# Altium schematic sheet DiagrammaStrutturale.SchDoc
size 420 x 297 mm; Address1: Address1; Address2: Address2; Address3: Address3; Address4: Address4; SheetNumber: 1; Scale: 1:1; Разраб.: Иванов; Обозначение документа: АБВГ.123456.001 Э3; Пров.: Петров; Утв.: Сидоров; Наименование организации: ОАО "Концерн "МПО-Гидроприбор"; Перв. применение: АБВГ.123456.000; Наименование изделия 1: Плата; Наименование изделия 2: Схема электрическая; Наименование изделия 3: принципиальная; Нач. отд.: Нач. отд.; Фамилия нач. отд.: Сидоров
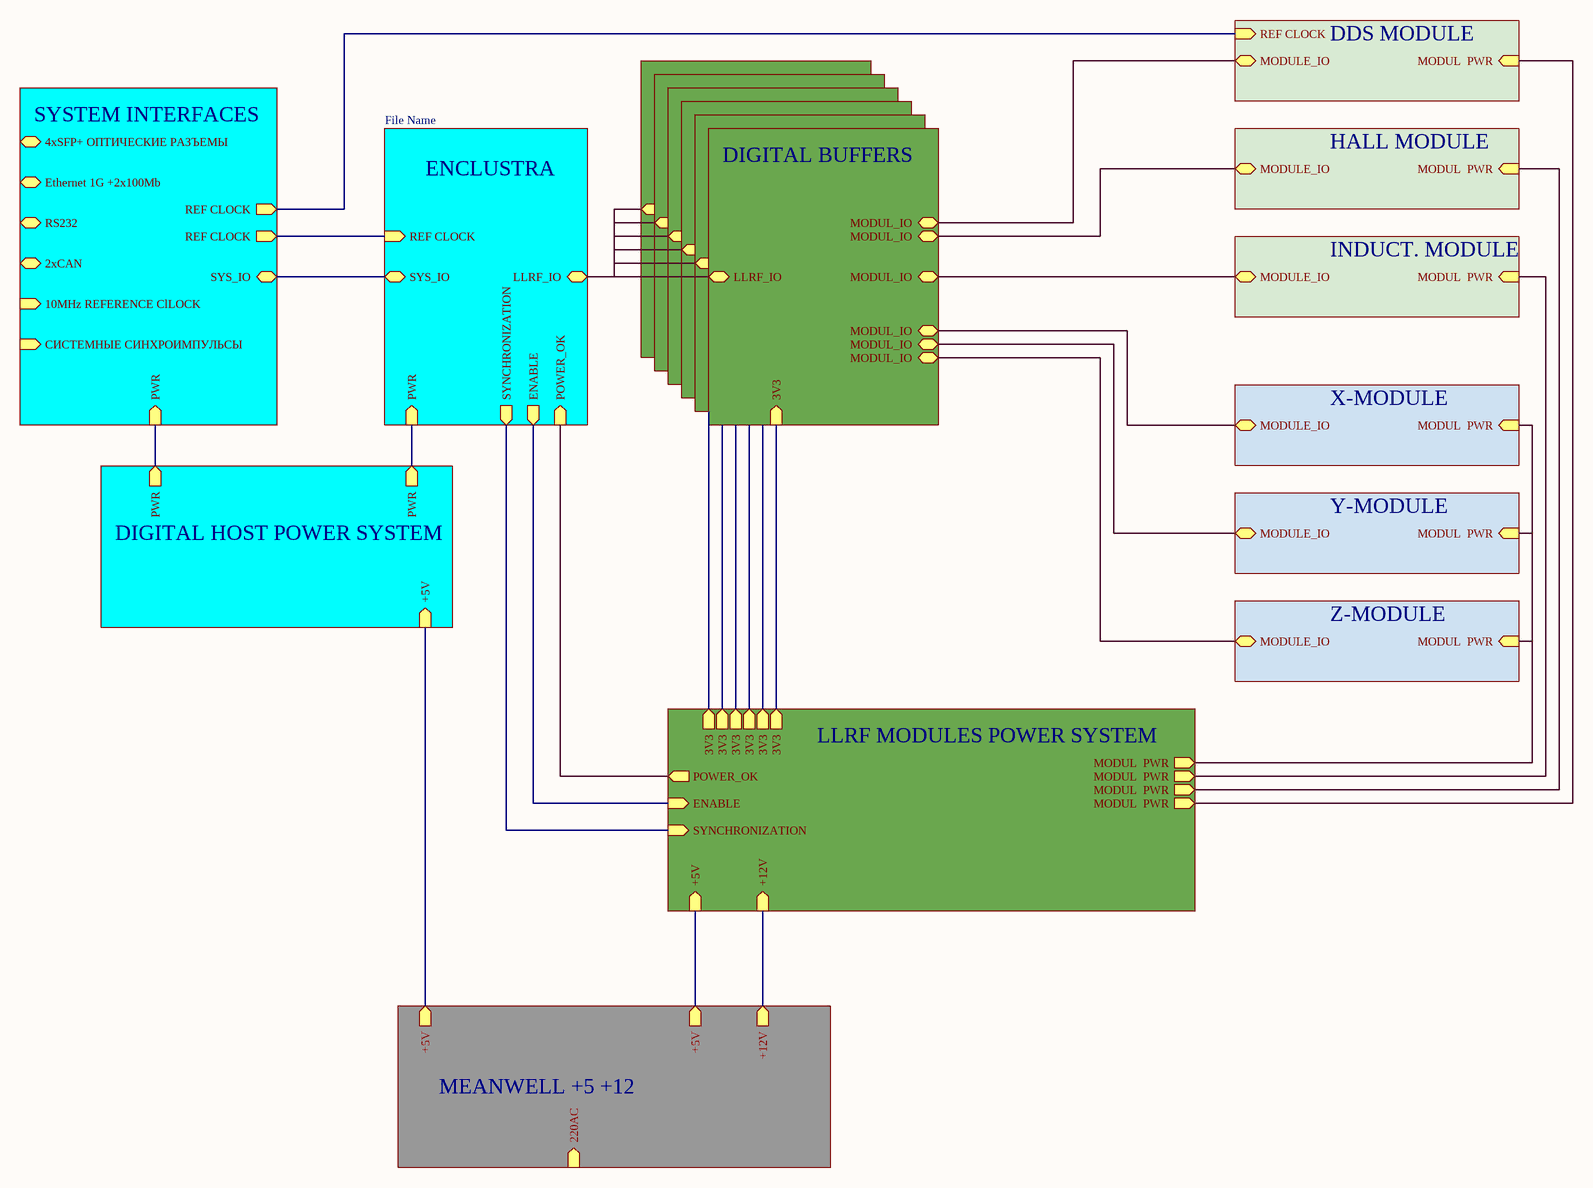
[diagram p0: DiagrammaStrutturale.SchDoc]

## Sub-sheets
DDS MODULE = File Name: MODUL  PWR (in), REF CLOCK (in), MODULE_IO (bidir)
DIGITAL BUFFERS = File Name: LLRF_IO (bidir), 3V3 (in), MODUL_IO (bidir)
DIGITAL BUFFERS = File Name: LLRF_IO (bidir), 3V3 (in), MODUL_IO (bidir)
DIGITAL BUFFERS = File Name: LLRF_IO (bidir), 3V3 (in), MODUL_IO (bidir)
DIGITAL BUFFERS = File Name: LLRF_IO (bidir), 3V3 (in), MODUL_IO (bidir)
DIGITAL BUFFERS = File Name: LLRF_IO (bidir), 3V3 (in), MODUL_IO (bidir)
DIGITAL BUFFERS = File Name: LLRF_IO (bidir), MODUL_IO (bidir), MODUL_IO (bidir), MODUL_IO (bidir), MODUL_IO (bidir), MODUL_IO (bidir), MODUL_IO (bidir), 3V3 (in)
DIGITAL HOST POWER SYSTEM = File Name: +5V (in), PWR (out), PWR (out)
ENCLUSTRA = File Name: PWR (in), SYS_IO (bidir), LLRF_IO (bidir), POWER_OK (in), REF CLOCK (in), ENABLE (out), SYNCHRONIZATION (out)
HALL MODULE = File Name: MODUL  PWR (in), MODULE_IO (bidir)
INDUCT. MODULE = File Name: MODUL  PWR (in), MODULE_IO (bidir)
LLRF MODULES POWER SYSTEM = File Name: 3V3 (out), +5V (in), +12V (in), 3V3 (out), 3V3 (out), 3V3 (out), 3V3 (out), 3V3 (out), MODUL  PWR (out), MODUL  PWR (out), MODUL  PWR (out), MODUL  PWR (out), POWER_OK (out), ENABLE (in), SYNCHRONIZATION (in)
MEANWELL +5 +12 = File Name: +5V (out), +5V (out), +12V (out), 220AC (in)
SYSTEM INTERFACES = File Name: 4xSFP+ ОПТИЧЕСКИЕ РАЗЪЕМЫ (bidir), Ethernet 1G +2x100Mb (bidir), RS232 (bidir), 2xCAN (bidir), 10MHz REFERENCE ClLOCK (in), СИСТЕМНЫЕ СИНХРОИМПУЛЬСЫ (in), SYS_IO (bidir), PWR (in), REF CLOCK (out), REF CLOCK (out)
X-MODULE = File Name: MODUL  PWR (in), MODULE_IO (bidir)
Y-MODULE = File Name: MODUL  PWR (in), MODULE_IO (bidir)
Z-MODULE = File Name: MODUL  PWR (in), MODULE_IO (bidir)

## Nets
(unnamed): sheet SYSTEM INTERFACES/SYS_IO, sheet ENCLUSTRA/SYS_IO
(unnamed): sheet SYSTEM INTERFACES/PWR, sheet DIGITAL HOST POWER SYSTEM/PWR
(unnamed): sheet SYSTEM INTERFACES/REF CLOCK, sheet ENCLUSTRA/REF CLOCK
(unnamed): sheet SYSTEM INTERFACES/REF CLOCK, sheet DDS MODULE/REF CLOCK
(unnamed): sheet ENCLUSTRA/PWR, sheet DIGITAL HOST POWER SYSTEM/PWR
(unnamed): sheet ENCLUSTRA/ENABLE, sheet LLRF MODULES POWER SYSTEM/ENABLE
(unnamed): sheet ENCLUSTRA/SYNCHRONIZATION, sheet LLRF MODULES POWER SYSTEM/SYNCHRONIZATION
(unnamed): sheet MEANWELL +5 +12/+5V, sheet DIGITAL HOST POWER SYSTEM/+5V
(unnamed): sheet MEANWELL +5 +12/+5V, sheet LLRF MODULES POWER SYSTEM/+5V
(unnamed): sheet MEANWELL +5 +12/+12V, sheet LLRF MODULES POWER SYSTEM/+12V
(unnamed): sheet LLRF MODULES POWER SYSTEM/3V3, sheet DIGITAL BUFFERS/3V3

## Buses and harness runs
bus sheet DDS MODULE/MODUL  PWR = sheet LLRF MODULES POWER SYSTEM/MODUL  PWR
bus sheet DDS MODULE/MODULE_IO = sheet DIGITAL BUFFERS/MODUL_IO
bus sheet DIGITAL BUFFERS/LLRF_IO = sheet ENCLUSTRA/LLRF_IO
bus sheet DIGITAL BUFFERS/MODUL_IO = sheet HALL MODULE/MODULE_IO
bus sheet DIGITAL BUFFERS/MODUL_IO = sheet INDUCT. MODULE/MODULE_IO
bus sheet DIGITAL BUFFERS/MODUL_IO = sheet X-MODULE/MODULE_IO
bus sheet DIGITAL BUFFERS/MODUL_IO = sheet Y-MODULE/MODULE_IO
bus sheet DIGITAL BUFFERS/MODUL_IO = sheet Z-MODULE/MODULE_IO
bus sheet ENCLUSTRA/POWER_OK = sheet LLRF MODULES POWER SYSTEM/POWER_OK
bus sheet HALL MODULE/MODUL  PWR = sheet LLRF MODULES POWER SYSTEM/MODUL  PWR
bus sheet INDUCT. MODULE/MODUL  PWR = sheet LLRF MODULES POWER SYSTEM/MODUL  PWR
bus sheet LLRF MODULES POWER SYSTEM/MODUL  PWR = sheet X-MODULE/MODUL  PWR = sheet Y-MODULE/MODUL  PWR = sheet Z-MODULE/MODUL  PWR

## Notes on the sheet
- Перв. примен.
- Справ. №
- Подп. и дата
- Инв. № дубл.
- Взам. инв. №
- Разраб.
- Изм.
- Лист
- № докум.
- Подп.
- Дата
- Лит.
- Масса
- Масштаб
- Пров.
- Т.контр.
- Листов
- Инв. № подл.
- Утв.
- Н.контр.
- Копировал
- Формат А3